# Altium schematic sheet PWR_PROT.SchDoc
size A4; SheetNumber: 13; SheetTotal: 15
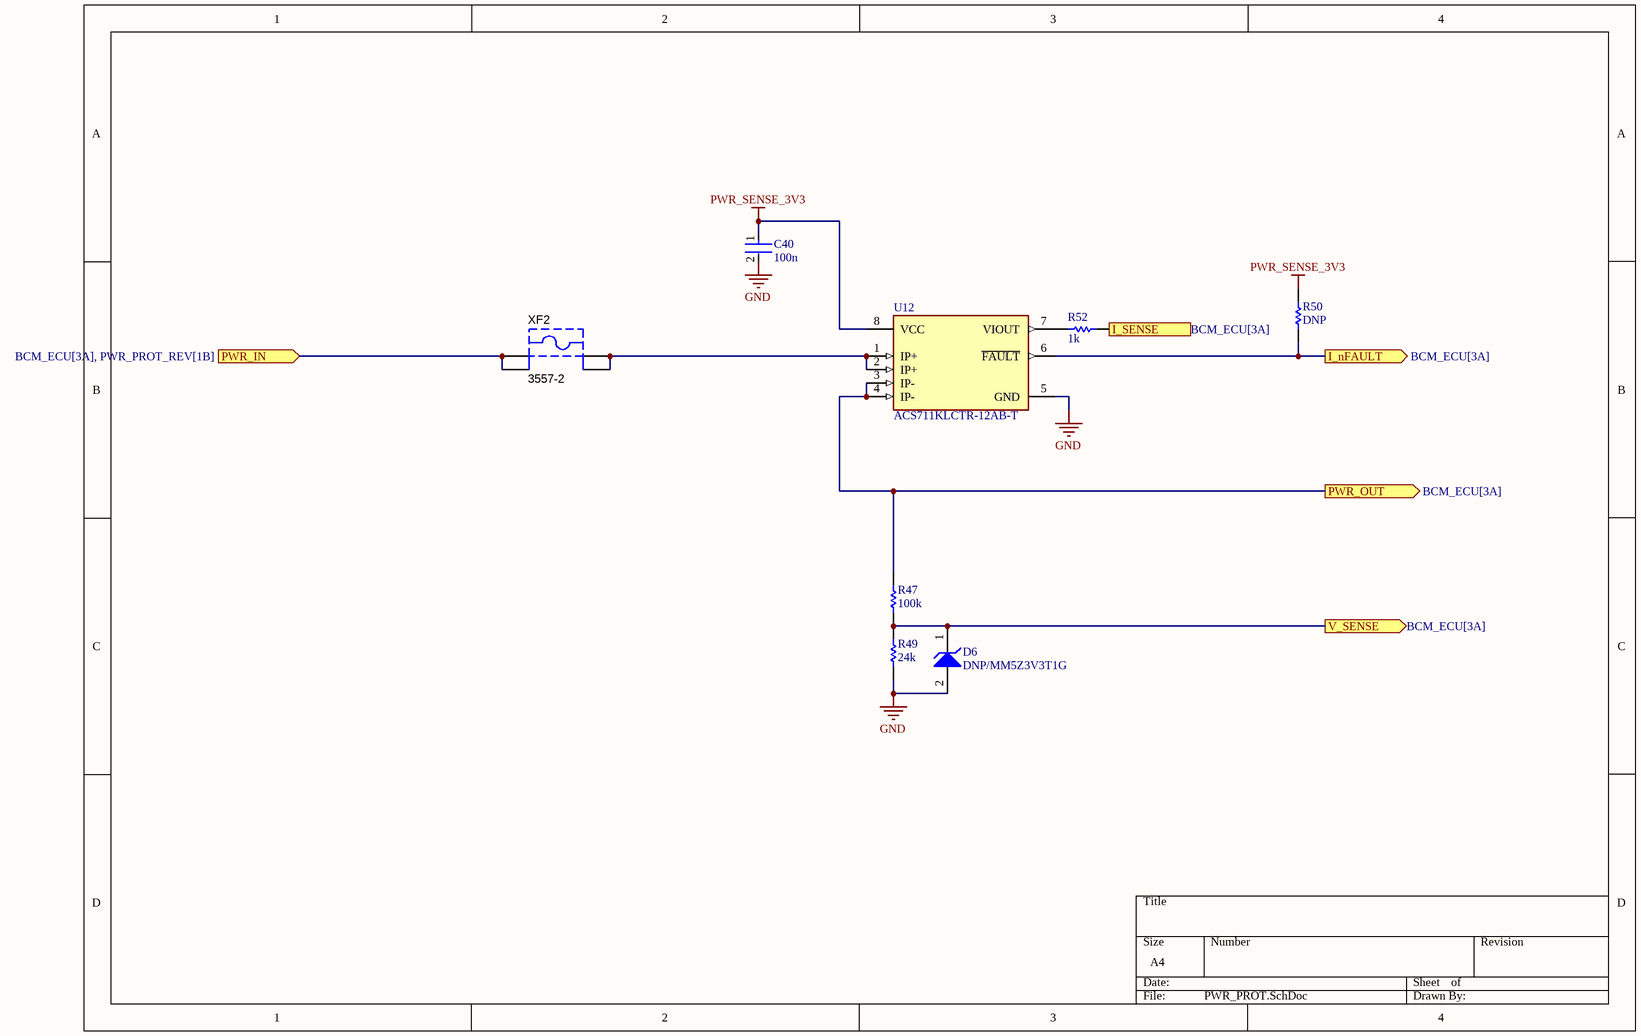
[diagram p0: PWR_PROT.SchDoc]

## Parts
C40  100n  [FP-0402-L_1_0_0_05-W_0_5-IPC_A]
D6  DNP/MM5Z3V3T1G  [ONSC-SOD-523-2-502-01_V]
R47  100k  [R0603B]
R49  24k  [R0603B]
R50  DNP  [R0603B]
R52  1k  [R0603B]
U12  ACS711KLCTR-12AB-T  [FP-LC-8-IPC_C]
XF2  3557-2  [KSTN-3557-2]

## Ports
I_nFAULT (out, see BCM_ECU[3A]), I_SENSE (out, see BCM_ECU[3A]), PWR_IN (in, see BCM_ECU[3A], PWR_PROT_REV[1B]), PWR_OUT (out, see BCM_ECU[3A]), V_SENSE (out, see BCM_ECU[3A])

## Nets
GND: C40.2 D6.2(A) R49.2 U12.5(GND)
PWR_SENSE_3V3: C40.1 R50.1 U12.8(VCC)
I_nFAULT: R50.2 U12.6(~{FAULT}) ; port I_nFAULT
I_SENSE: R52.1 ; port I_SENSE
PWR_IN: XF2.1 XF2.2 ; port PWR_IN
PWR_OUT: R47.1 U12.3(IP-) U12.4(IP-) ; port PWR_OUT
V_SENSE: D6.1(K) R47.2 R49.1 ; port V_SENSE
NetR52_2: R52.2 U12.7(VIOUT)
NetU12_1: U12.1(IP+) U12.2(IP+) XF2.3 XF2.4

## Library data of the parts
C40 = CMP-001-00058-1: LARGE PADS, 0402 CAP, CHANGE COMMENT TO MATCH REAL P/N; Capacitor Type: Ceramic; Min Operating Temperature: -55°C; Mounting Technology: Surface Mount; Pins: 2; Case/Package: 0402; RoHS Compliant: Yes; Max Operating Temperature: 85°C
D6 = CMP-1060-00750-1: Zener Voltage Regulator, 500 mW, 2-Pin SOD-523, Pb-Free, Tape and Reel; Manufacturer: On Semiconductor; P Max (W): 0.5; VZ Typ (V): 3.3; RoHS: Pb-Free; ComponentLink2Description: Datasheet; PackageReference: SOD-523-2-502-01; DatasheetVersion: Rev. 10; ComponentLink1Description: Manufacturer URL; PackageVersion: Rev. E, 09/2010; ComponentLink3URL: http://www.onsemi.com/pub_link/Collateral/502-01.PDF; ComponentLink2URL: http://www.onsemi.cn/pub_link/Collateral/MM5Z2V4T1-D.PDF; Mounting Technology: Surface Mount; PartNumber: MM5Z3V3T1G; Packing: Tape and Reel; PackageDescription: 2-Pin SOD, Body 1.2 x 0.8 mm; ComponentLink1URL: http://www.onsemi.com/; ComponentLink3Description: Package Specification
R47 R50 = CMP-009-00002-14: Resistor; Value: 10k
R49 = CMP-009-00002-14: Resistor; Value: 2.7k
R52 = CMP-009-00002-14: Resistor; Value: 1k
U12 = CMP-1557-00012-2: SENSOR CURRENT HALL 12.5A AC/DC; Number of Channels: 1; Min Supply Voltage: 3V; Sensitivity: 110mV/A; Response Time: 4.6us; Operating Supply Voltage: 3.3V; Max Supply Voltage: 5.5V; Max Supply Current: 5.5mA; Bandwidth: 100kHz; Linearity: 1%; Quiescent Current: 4mA; Accuracy: 5%; Polarity: Bidirectional; Case/Package: SOIC; Packaging: Tape and Reel; Number of Pins: 8; Width: 3.9mm; Frequency: 100kHz; -3db Bandwidth: 100kHz; REACH SVHC: No SVHC; Series: -; Height: 1.5mm; Package Quantity: 1; Min Operating Temperature: -40°C; Max Operating Temperature: 125°C; Current Sensing: 12.5A; RoHS Compliant: Yes; Length: 4.9mm
XF2 = CMP-2000-05461-1: FUSE HOLDER, PCB MOUNT, 500VAC, 20A, ROHS; Manufacturer: Keystone-Electronics; Number of Circuits: 1; Voltage: 500V; Fuseholder Type: Block; Fuse Type: Blade; Fuse Size: 0.43"Lx0.15"Wx0.64"H(10.92mmx3.81mmx16.25mm); For Use With/Related Products: ATC,ATO257,MINI897; Current Rating: 30A; Datasheet URL: http://datasheet.octopart.com/3557-2-Keystone-datasheet-15715937.pdf; Orientation: Vertical; Family: Fuseholders; Datasheet Version: Apr-13; Contact Finish: TinNickel; Mounting Type: PCB; Series: -; Category: CircuitProtection; Termination Style: PCPin; Contact Material: Brass; Manufacturer URL: http://www.keyelco.com/